# Altium schematic sheet Sheet2.SchDoc
size A4; SheetNumber: 2; SheetTotal: 6
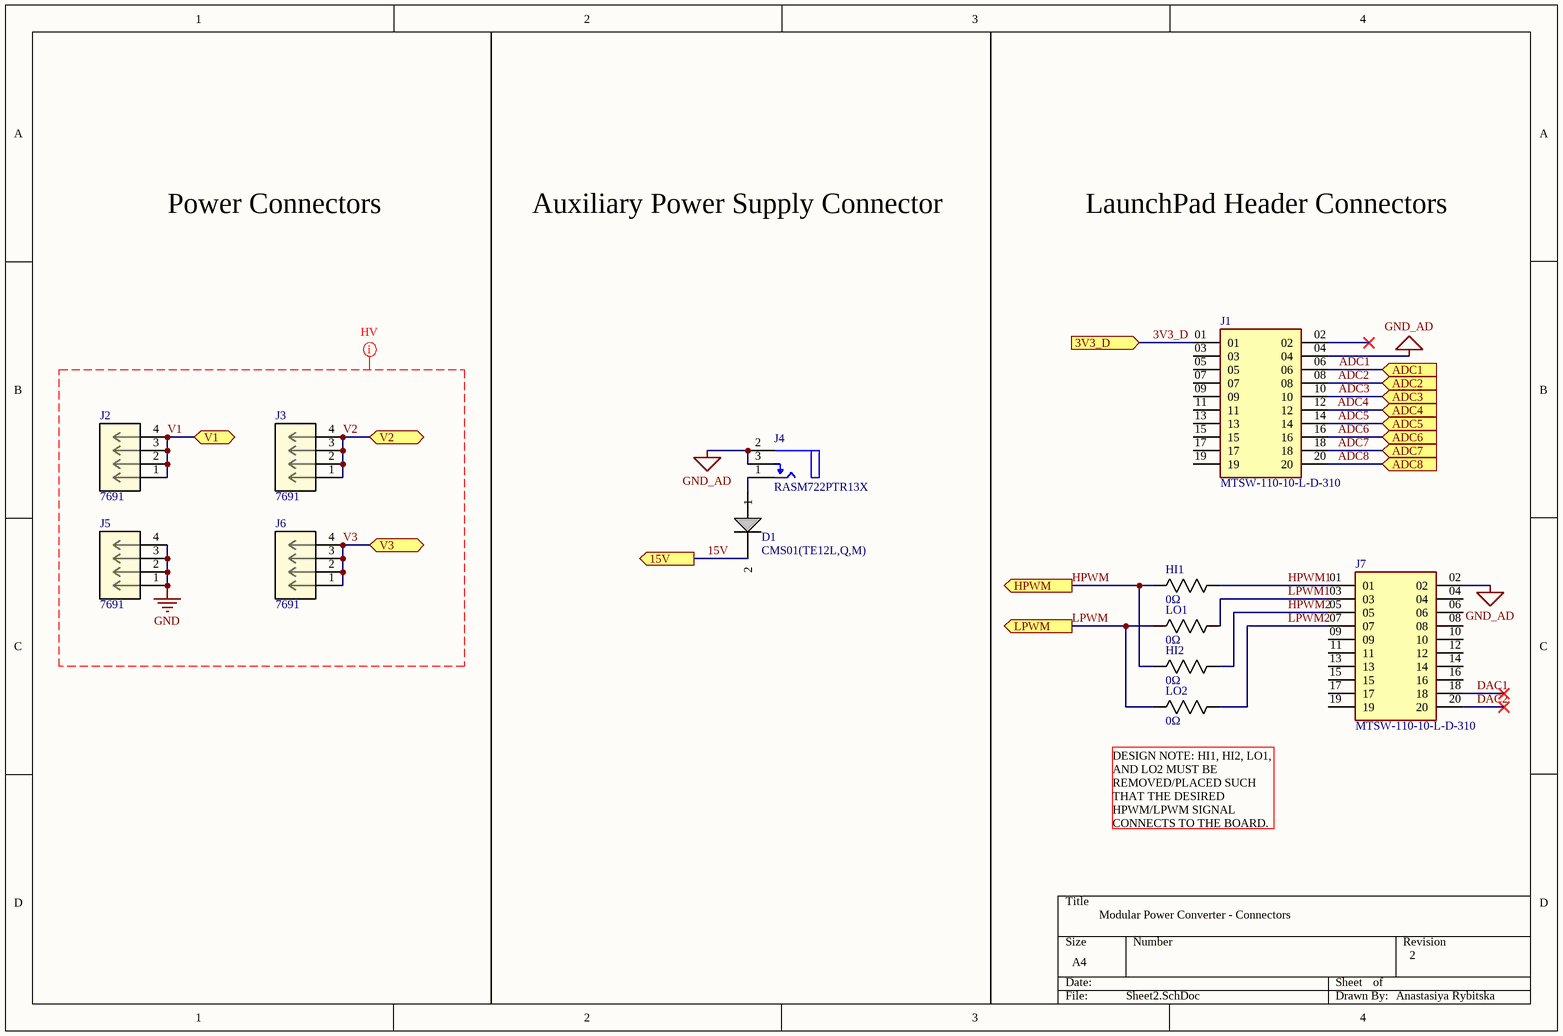
[diagram p0: Sheet2.SchDoc]

## Parts
D1  CMS01(TE12L,Q,M)  [M-FLAT_TOS]
HI1  Resistance: 0Ω  [0603]  (hidden comment: AC0603FR-070RL)
HI2  Resistance: 0Ω  [0603]  (hidden comment: AC0603FR-070RL)
J1  MTSW-110-10-L-D-310  [SAMTEC_MTSW-110-10-L-D-310]
J2  7691  [CONN_8191_KEY]
J3  7691  [CONN_8191_KEY]
J4  RASM722PTR13X  [FP-RASM722PTR13X-MFG]
J5  7691  [CONN_8191_KEY]
J6  7691  [CONN_8191_KEY]
J7  MTSW-110-10-L-D-310  [SAMTEC_MTSW-110-10-L-D-310]
LO1  Resistance: 0Ω  [0603]  (hidden comment: AC0603FR-070RL)
LO2  Resistance: 0Ω  [0603]  (hidden comment: AC0603FR-070RL)

## Ports
3V3_D (in), 15V (out), ADC1 (in), ADC2 (in), ADC3 (in), ADC4 (in), ADC5 (in), ADC6 (in), ADC7 (in), ADC8 (in), HPWM (out), LPWM (out), V1 (bidir), V2 (bidir), V3 (bidir)

## Nets
GND: J5.1 J5.2 J5.3 J5.4
GND_AD: J1.04 J4.2(SLEEVE_TERMINAL) J4.3(SHUNT_TERMINAL) J7.02
3V3_D: J1.01 ; port 3V3_D
15V: D1.2 ; port 15V
ADC1: J1.06 ; port ADC1
ADC2: J1.08 ; port ADC2
ADC3: J1.10 ; port ADC3
ADC4: J1.12 ; port ADC4
ADC5: J1.14 ; port ADC5
ADC6: J1.16 ; port ADC6
ADC7: J1.18 ; port ADC7
ADC8: J1.20 ; port ADC8
DAC1: J7.18
DAC2: J7.20
HPWM: HI1.1 HI2.1 ; port HPWM
HPWM1: HI1.2 J7.01
HPWM2: HI2.2 J7.05
LPWM: LO1.1 LO2.1 ; port LPWM
LPWM1: J7.03 LO1.2
LPWM2: J7.07 LO2.2
V1: J2.1 J2.2 J2.3 J2.4 ; port V1
V2: J3.1 J3.2 J3.3 J3.4 ; port V2
V3: J6.1 J6.2 J6.3 J6.4 ; port V3
NetD1_1: D1.1 J4.1(TIP_TERMINAL(CENTER_PIN))

Not connected (* = marked no-connect by the designer): J1 02* 03 05 07 09 11 13 15 17 19; J7 04 06 08 09 10 11 12 13 14 15 16 17 19

## Layout directives
rule Clearance Constraint [Clearance = 0.6mm]: GND, V1, V2, V3

## Notes on the sheet
- Power Connectors
- Auxiliary Power Supply Connector
- LaunchPad Header Connectors
- (near LO2) DESIGN NOTE: HI1, HI2, LO1, AND LO2 MUST BE REMOVED/PLACED SUCH THAT THE DESIRED HPWM/LPWM SIGNAL CONNECTS TO THE BOARD.
- Modular Power Converter - Connectors
- 2
- Anastasiya Rybitska

## Library data of the parts
D1 = CMS01(TE12L,Q,M): No Description Available; Mfr_Name: Toshiba Electronic Devices & Storage Co.; Type: DEV; Number_devices_in_Package: 1; Copyright: Copyright (C) 2022 Ultra Librarian. All rights reserved.; Manufacturer_Part_Number: CMS01(TE12L,Q,M); Digi-Key_Part_Number_1: CMS01QTR-ND; Digi-Key_Part_Number_2: CMS01QCT-ND; Digi-Key_Part_Number_3: CMS01QDKR-ND; RefDes: RefDes; Source_Package: CMS01
HI1 HI2 LO1 LO2 = AC0603FR-070RL: RES SMD 0 OHM JUMPER 1/10W 0603
J2 J3 J5 J6 = 7691: TERM SCREW 6-32 4 PIN PCB; Mfr_Name: Keystone Electronics; Copyright: Copyright (C) 2022 Ultra Librarian. All rights reserved.; Manufacturer_Part_Number: 7691; Digi-Key_Part_Number_1: 36-8191-ND; Digi-Key_Part_Number_2: 8191K-ND; Digi-Key_Part_Number_3: 36-8191-NDL; RefDes: RefDes; Type: DEV
J4 = CMP-47995-000002-1: CONN PWR JACK 2.1X5.5MM SOLDER; Shielding: Unshielded; Gender: Male; Current Rating: 5A; Termination: Solder; Contact Material: Copper Alloy; Package Quantity: 120; Case/Package: SMD/SMT; Contact Plating: Tin; Connector Type: Jack; Housing Material: Thermoplastic; Mount: Surface Mount; Housing Color: Black; Color: Black
J1 J7 = MTSW-110-10-L-D-310: Package: None; Price: None; Value: *; MP: MTSW-110-10-L-D-310; Availability: Unavailable